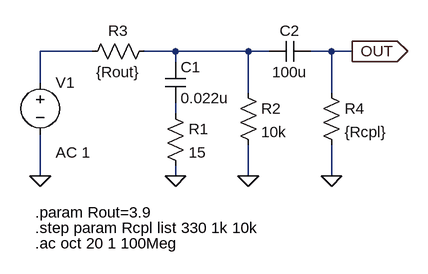
[diagram p0: schematic PCM2704_Snubber.asc]
PCM2704_Snubber.asc, the LTspice schematic file:
Version 4
SHEET 1 880 680
WIRE 80 64 0 64
WIRE 208 64 160 64
WIRE 320 64 208 64
WIRE 352 64 320 64
WIRE 448 64 416 64
WIRE 480 64 448 64
WIRE 208 80 208 64
WIRE 0 112 0 64
WIRE 320 128 320 64
WIRE 448 128 448 64
WIRE 208 160 208 144
WIRE 0 256 0 192
WIRE 208 256 208 240
WIRE 320 256 320 208
WIRE 448 256 448 208
FLAG 208 256 0
FLAG 320 256 0
FLAG 0 256 0
FLAG 448 256 0
FLAG 480 64 OUT
IOPIN 480 64 Out
SYMBOL cap 192 80 R0
SYMATTR InstName C1
SYMATTR Value 0.022u
SYMBOL res 192 144 R0
SYMATTR InstName R1
SYMATTR Value 15
SYMBOL res 304 112 R0
SYMATTR InstName R2
SYMATTR Value 10k
SYMBOL voltage 0 96 R0
WINDOW 123 24 124 Left 2
WINDOW 39 0 0 Left 0
SYMATTR Value2 AC 1
SYMATTR InstName V1
SYMATTR Value ""
SYMBOL res 176 48 R90
WINDOW 0 0 56 VBottom 2
WINDOW 3 32 56 VTop 2
SYMATTR InstName R3
SYMATTR Value {Rout}
SYMBOL cap 416 48 R90
WINDOW 0 0 32 VBottom 2
WINDOW 3 32 32 VTop 2
SYMATTR InstName C2
SYMATTR Value 100u
SYMBOL res 432 112 R0
SYMATTR InstName R4
SYMATTR Value {Rcpl}
TEXT -8 312 Left 2 !.param Rout=3.9
TEXT -8 360 Left 2 !.ac oct 20 1 100Meg
TEXT -8 336 Left 2 !.step param Rcpl list 330 1k 10k

The netlist it stands for:
* PCM2704_Snubber.asc
C1 N002 N003 0.022u
R1 N003 0 15
R2 N002 0 10k
V1 N001 0 AC 1
R3 N002 N001 {Rout}
C2 OUT N002 100u
R4 OUT 0 {Rcpl}
.param Rout=3.9
.ac oct 20 1 100Meg
.step param Rcpl list 330 1k 10k
.backanno
.end